# EasyEDA Pro project Modular-Analog-Synthesizer.eprj, schematic Schematic4
Board Name: mixer; Create Date: 2026-04-13; Page Name: mixer-circuit; Project Name: Modular-Analog-Synthesizer; Schematic Name: Schematic4; Update Date: 2026-04-14; Company: EasyEDA.com; Page Size: A4; Version: V1.0
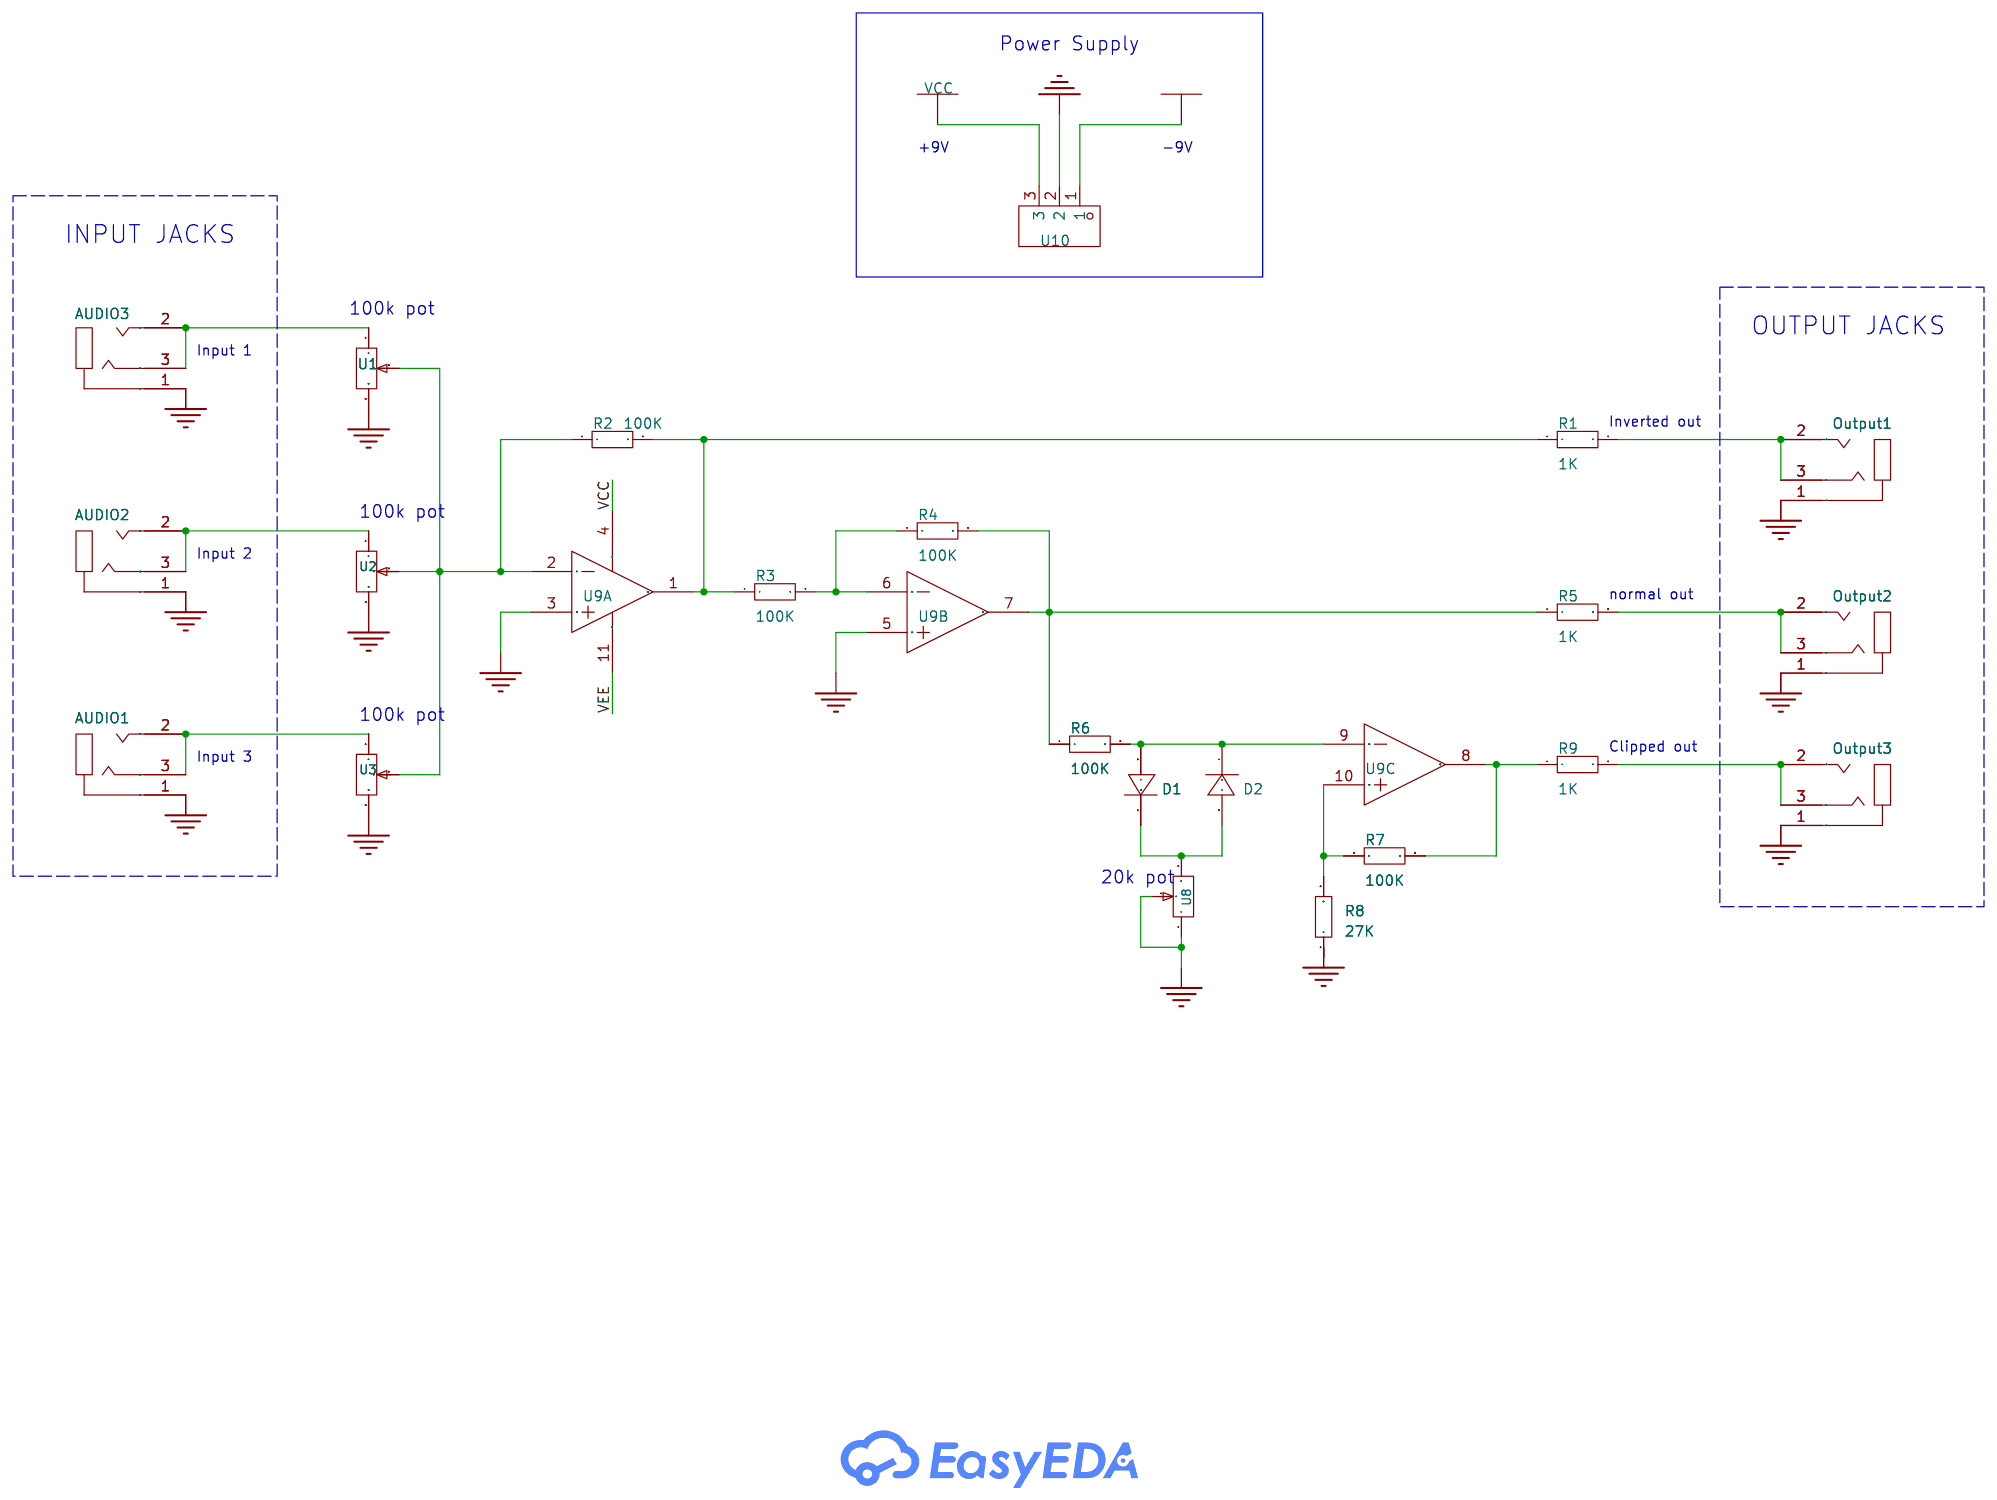
[diagram p3: schematic sheet]

## Parts
AUDIO1  -  [AUDIO-SMD_PJ-313D]
AUDIO2  -  [AUDIO-SMD_PJ-313D]
AUDIO3  -  [AUDIO-SMD_PJ-313D]
D1  -  [SOD-123_L2.8-W1.8-LS3.7-RD]
D2  -  [SOD-123_L2.8-W1.8-LS3.7-RD]
Output1  -  [AUDIO-SMD_PJ-313D]
Output2  -  [AUDIO-SMD_PJ-313D]
Output3  -  [AUDIO-SMD_PJ-313D]
R1  1K  [R0603]
R2  100K  [R0603]
R3  100K  [R0603]
R4  100K  [R0603]
R5  1K  [R0603]
R6  100K  [R0603]
R7  100K  [R0603]
R8  27K  [R0603]
R9  1K  [R0603]
U1  Pot-100k  [RES-ADJ-SMD_VG039NCH]
U2  Pot-100k  [RES-ADJ-SMD_VG039NCH]
U3  Pot-100k  [RES-ADJ-SMD_VG039NCH]
U8  Pot-100k  [RES-ADJ-SMD_VG039NCH]
U9  -  [SOIC-14_L8.7-W3.9-P1.27-LS6.0-BL]  (sections 1,2,3)
U10  -  [CONN-TH_3P-P5.00_KF301-5.0-3P]

## Library data of the parts
AUDIO1-AUDIO3 Output1-Output3 = PJ-313D-6A: LCSC Part Name: 3.5mm耳机座; Supplier Part: C95463; Manufacturer: 韩国韩荣; Supplier Footprint: SMD; JLCPCB Part Class: Extended Part; Datasheet: https://atta.szlcsc.com/upload/public/pdf/source/20191118/C95463_33C76E25D98A90BB88D1795912C97EA2.pdf; Supplier: LCSC; Connector Type: 3.5mm耳机座; Current Rating (Max): 500mA; Voltage Rating (Max): 30V
D1 D2 = 1N4148W: LCSC Part Name: 75V 150mA 4ns; Supplier Part: C109203; Manufacturer: SHIKUES(时科); Supplier Footprint: SOD-123; JLCPCB Part Class: Extended Part; Datasheet: https://atta.szlcsc.com/upload/public/pdf/source/20170717/C109203_1500269933227820712.pdf; Supplier: LCSC; Forward Voltage (Vf@If): 1.25V@150mA; Reverse Leakage Current: 1μA@75V; Operating Temperature: +150℃@(Tj)
R1-R9 = Res_0603: Supplier Footprint: 0603
U1-U3 U8 = 3*3Potentiometer-10kΩ20%: Supplier Part: C9900010776; Supplier Footprint: SMD-3P; JLCPCB Part Class: Extended Part; Supplier: LCSC
U9 = TL074IDT: Supplier Part: C107644; Manufacturer: ST(意法半导体); Supplier Footprint: SOIC-14_150mil; JLCPCB Part Class: Extended Part; Datasheet: https://atta.szlcsc.com/upload/public/pdf/source/20170413/1492062785245.pdf; Supplier: LCSC
U10 = KF301-5.0-3P: LCSC Part Name: 5mm 排数:1 每排P数:3 直针 可拼接 铜 环保; Supplier Part: C474882; Manufacturer: KEFA(科发); Supplier Footprint: P=5mm; JLCPCB Part Class: Extended Part; Datasheet: https://atta.szlcsc.com/upload/public/pdf/source/20200115/C474882_067BD45A25E5311BED9DE634CF3E69D8.pdf; Supplier: LCSC; Pitch: 5mm; Number of Rows: 1; Number of PINs Per Row: 3; Mounting Style: 直针; Current Rating (Max): 17A; Voltage Rating (Max): 250V; Wire Gauge - AWG: 14~22; Wire Gauge - mm?: 1.5; Operating Temperature Range: -30℃~+120℃; Color: Blue

## Nets
GND: AUDIO1.1 AUDIO2.1 AUDIO3.1 Output1.1 Output2.1 Output3.1 R8.1 U1.3 U2.3 U3.3 U8.1 U8.2 U9.3(1IN+) U9.5(2IN+) U10.2
VCC: U9.4(VCC+) U10.3
VEE: U9.11(VCC-) U10.1
$1N266: AUDIO3.2 AUDIO3.3 U1.1
$1N273: AUDIO2.2 AUDIO2.3 U2.1
$1N278: AUDIO1.2 AUDIO1.3 U3.1
$1N291: R2.1 U1.2 U2.2 U3.2 U9.2(1IN-)
$1N494: Output1.2 Output1.3 R1.2
$1N500: R1.1 R2.2 R3.1 U9.1(1OUT)
$1N737: R3.2 R4.1 U9.6(2IN-)
$1N887: Output2.2 Output2.3 R5.2
$1N893: R4.2 R5.1 R6.1 U9.7(2OUT)
$1N1038: D1.2(A) D2.1(C) R6.2 U9.9(3IN-)
$1N1050: D1.1(C) D2.2(A) U8.3
$1N1253: R7.1 R8.2 U9.10(3IN+)
$1N1269: R7.2 R9.1 U9.8(3OUT)
$1N1360: Output3.2 Output3.3 R9.2

## Notes on the sheet
- Power Supply
- +9V
- -9V
- INPUT JACKS
- 100k pot
- Input 1
- OUTPUT JACKS
- Inverted out
- 100k pot
- Input 2
- normal out
- 100k pot
- Input 3
- Clipped out
- 20k pot
